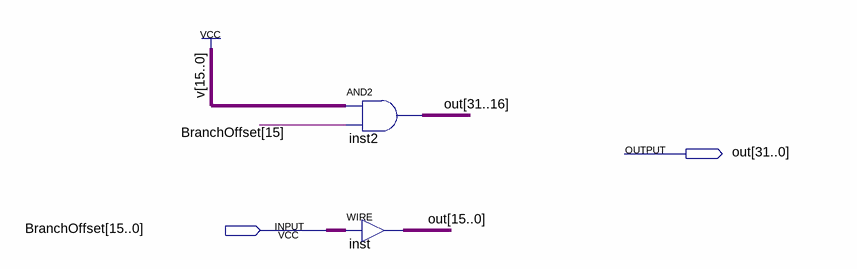
[diagram p0: schematic sheet]
// Quartus schematic SignExtend.bdf as structural Verilog: 2 symbols, 2 pins
module SignExtend (
  input  [15:0] BranchOffset,
  output [31:0] out
);

  assign out[31:16] = {16{1'b1}} & {16{BranchOffset[15]}};  // AND2 inst2, 16 bits wide
  assign out[15:0] = BranchOffset;  // WIRE inst
endmodule
